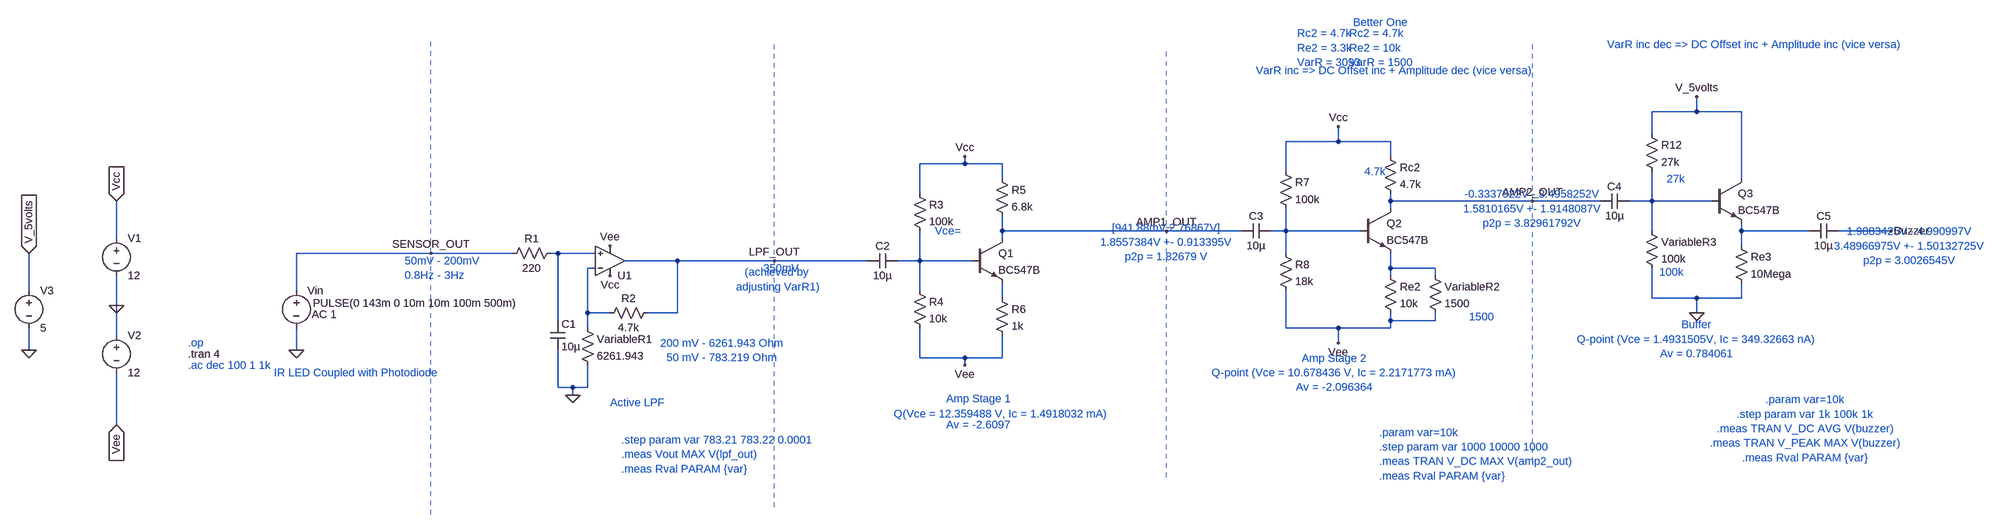
[diagram p0: schematic FINAL (1).asc]
FINAL (1).asc, the LTspice schematic file:
Version 4.1
SHEET 1 4272 964
WIRE 3216 -224 3216 -256
WIRE 3216 -224 3120 -224
WIRE 3312 -224 3216 -224
WIRE 3120 -176 3120 -224
WIRE 2448 -160 2448 -192
WIRE 2448 -160 2336 -160
WIRE 2560 -160 2448 -160
WIRE 2560 -128 2560 -160
WIRE 1648 -112 1648 -128
WIRE 1648 -112 1552 -112
WIRE 1728 -112 1648 -112
WIRE 2336 -96 2336 -160
WIRE 1728 -80 1728 -112
WIRE 3312 -80 3312 -224
WIRE 1552 -48 1552 -112
WIRE 2560 -32 2560 -48
WIRE 2864 -32 2560 -32
WIRE 3008 -32 2864 -32
WIRE 3120 -32 3120 -96
WIRE 3120 -32 3072 -32
WIRE 3248 -32 3120 -32
WIRE 2560 -16 2560 -32
WIRE 1728 32 1728 0
WIRE 2080 32 1728 32
WIRE 2240 32 2080 32
WIRE 2336 32 2336 -16
WIRE 2336 32 2304 32
WIRE 2496 32 2336 32
WIRE 3120 32 3120 -32
WIRE 3312 32 3312 16
WIRE 3456 32 3312 32
WIRE 3632 32 3520 32
WIRE -496 48 -496 -32
WIRE 1728 48 1728 32
WIRE 3312 64 3312 32
WIRE 496 80 208 80
WIRE 672 80 496 80
WIRE 768 80 752 80
WIRE 848 80 768 80
WIRE 2336 80 2336 32
WIRE 1024 96 912 96
WIRE 1232 96 1024 96
WIRE 1440 96 1232 96
WIRE 1552 96 1552 32
WIRE 1552 96 1504 96
WIRE 1664 96 1552 96
WIRE 848 112 832 112
WIRE 2560 112 2560 80
WIRE 2656 112 2560 112
WIRE 2560 128 2560 112
WIRE 2656 128 2656 112
WIRE -720 160 -720 80
WIRE 208 160 208 80
WIRE 1552 160 1552 96
WIRE 1728 176 1728 144
WIRE 3120 176 3120 112
WIRE 3216 176 3120 176
WIRE 3312 176 3312 144
WIRE 3312 176 3216 176
WIRE -496 192 -496 128
WIRE 832 208 832 112
WIRE 880 208 832 208
WIRE 1024 208 1024 96
WIRE 1024 208 960 208
WIRE 3216 208 3216 176
WIRE 768 224 768 80
WIRE 2560 224 2560 208
WIRE 2656 224 2656 208
WIRE 2656 224 2560 224
WIRE 832 240 832 208
WIRE 2336 240 2336 160
WIRE 2448 240 2336 240
WIRE 2560 240 2560 224
WIRE 2560 240 2448 240
WIRE -496 256 -496 192
WIRE 2448 272 2448 240
WIRE -720 288 -720 240
WIRE 208 288 208 240
WIRE 1552 304 1552 240
WIRE 1648 304 1552 304
WIRE 1728 304 1728 256
WIRE 1728 304 1648 304
WIRE 1648 320 1648 304
WIRE 768 368 768 288
WIRE 800 368 768 368
WIRE 832 368 832 320
WIRE 832 368 800 368
WIRE 800 384 800 368
WIRE -496 448 -496 336
FLAG 208 288 0
FLAG -496 192 0
FLAG -496 -32 Vcc
IOPIN -496 -32 In
FLAG -496 448 Vee
IOPIN -496 448 In
FLAG 800 384 0
FLAG 880 128 Vcc
FLAG 880 64 Vee
FLAG 1648 -128 Vcc
FLAG 1648 320 Vee
FLAG 2448 -192 Vcc
FLAG 2448 272 Vee
FLAG -720 288 0
FLAG -720 80 V_5volts
IOPIN -720 80 In
FLAG 3216 -256 V_5volts
FLAG 496 80 SENSOR_OUT
FLAG 1232 96 LPF_OUT
FLAG 2080 32 AMP1_OUT
FLAG 2864 -32 AMP2_OUT
FLAG 3216 208 0
FLAG 3632 32 Buzzer
DATAFLAG 3312 -144 "$-V(Buzzer)"
DATAFLAG 1728 32 "$-V(N008)"
DATAFLAG 2560 -32 "$-V(N007)"
DATAFLAG 1728 32 "$-V(N008)"
SYMBOL voltage 208 144 R0
WINDOW 3 35 43 Left 2
WINDOW 123 33 67 Left 2
WINDOW 39 0 0 Left 0
SYMATTR Value PULSE(0 143m 0 10m 10m 100m 500m)
SYMATTR Value2 AC 1
SYMATTR InstName Vin
SYMBOL res 768 64 R90
WINDOW 0 0 56 VBottom 2
WINDOW 3 32 56 VTop 2
SYMATTR InstName R1
SYMATTR Value 220
SYMBOL voltage -496 32 R0
SYMATTR InstName V1
SYMATTR Value 12
SYMBOL voltage -496 240 R0
SYMATTR InstName V2
SYMATTR Value 12
SYMBOL cap 752 224 R0
SYMATTR InstName C1
SYMATTR Value 10µ
SYMBOL res 976 192 R90
WINDOW 0 0 56 VBottom 2
WINDOW 3 32 56 VTop 2
SYMATTR InstName R2
SYMATTR Value 4.7k
SYMBOL res 816 224 R0
SYMATTR InstName VariableR1
SYMATTR Value 6261.943
SYMBOL cap 1504 80 R90
WINDOW 0 0 32 VBottom 2
WINDOW 3 32 32 VTop 2
SYMATTR InstName C2
SYMATTR Value 10µ
SYMBOL res 1536 -64 R0
SYMATTR InstName R3
SYMATTR Value 100k
SYMBOL res 1536 144 R0
SYMATTR InstName R4
SYMATTR Value 10k
SYMBOL res 1712 -96 R0
SYMATTR InstName R5
SYMATTR Value 6.8k
SYMBOL res 1712 160 R0
SYMATTR InstName R6
SYMATTR Value 1k
SYMBOL npn 1664 48 R0
SYMATTR InstName Q1
SYMATTR Value BC547B
SYMBOL cap 2304 16 R90
WINDOW 0 0 32 VBottom 2
WINDOW 3 32 32 VTop 2
SYMATTR InstName C3
SYMATTR Value 10µ
SYMBOL res 2320 -112 R0
SYMATTR InstName R7
SYMATTR Value 100k
SYMBOL res 2320 64 R0
SYMATTR InstName R8
SYMATTR Value 18k
SYMBOL res 2544 -144 R0
SYMATTR InstName Rc2
SYMATTR Value 4.7k
SYMBOL npn 2496 -16 R0
SYMATTR InstName Q2
SYMATTR Value BC547B
SYMBOL res 2544 112 R0
SYMATTR InstName Re2
SYMATTR Value 10k
SYMBOL cap 3072 -48 R90
WINDOW 0 0 32 VBottom 2
WINDOW 3 32 32 VTop 2
SYMATTR InstName C4
SYMATTR Value 10µ
SYMBOL res 3104 -192 R0
SYMATTR InstName R12
SYMATTR Value 27k
SYMBOL res 3104 16 R0
SYMATTR InstName VariableR3
SYMATTR Value 100k
SYMBOL npn 3248 -80 R0
SYMATTR InstName Q3
SYMATTR Value BC547B
SYMBOL res 3296 48 R0
SYMATTR InstName Re3
SYMATTR Value 10Mega
SYMBOL voltage -720 144 R0
WINDOW 123 0 0 Left 0
WINDOW 39 0 0 Left 0
SYMATTR InstName V3
SYMATTR Value 5
SYMBOL OpAmps\\UniversalOpAmp2 880 96 M180
SYMATTR InstName U1
SYMBOL res 2640 112 R0
SYMATTR InstName VariableR2
SYMATTR Value 1500
SYMBOL cap 3520 16 R90
WINDOW 0 0 32 VBottom 2
WINDOW 3 32 32 VTop 2
SYMATTR InstName C5
SYMATTR Value 10µ
TEXT -24 296 Left 2 !.tran 4
TEXT 160 336 Left 2 ;IR LED Coupled with Photodiode
TEXT 880 400 Left 2 ;Active LPF
TEXT 1608 392 Left 2 ;Amp Stage 1
TEXT -24 320 Left 2 ;.ac dec 100 1 1k
TEXT 1208 112 Left 2 ;350mV
TEXT -24 272 Left 2 ;.op
TEXT 1240 136 Center 2 ;(achieved by \nadjusting VarR1)
TEXT 904 480 Left 2 ;.step param var 783.21 783.22 0.0001\n.meas Vout MAX V(lpf_out)\n.meas Rval PARAM {var}
TEXT 1496 424 Left 2 ;Q(Vce = 12.359488 V, Ic = 1.4918032 mA)
TEXT 440 96 Left 2 ;50mV - 200mV\n0.8Hz - 3Hz
TEXT 2080 56 Center 2 ;[941.88mV,2.76867V]\n1.8557384V +- 0.913395V\np2p = 1.82679 V
TEXT 1608 448 Left 2 ;Av = -2.6097
TEXT 2536 464 Left 2 ;.param var=10k\n.step param var 1000 10000 1000\n.meas TRAN V_DC MAX V(amp2_out)\n.meas Rval PARAM {var}
TEXT 2440 336 Center 2 ;Amp Stage 2\nQ-point (Vce = 10.678436 V, Ic = 2.2171773 mA)\nAv = -2.096364
TEXT 2864 -16 Center 2 ;-0.3337922V - 3.4958252V\n1.5810165V +- 1.9148087V\np2p = 3.82961792V
TEXT 1120 288 Center 2 ;200 mV - 6261.943 Ohm\n50 mV - 783.219 Ohm
TEXT 2360 -392 Left 2 ;Rc2 = 4.7k\nRe2 = 3.3k\nVarR = 3093
TEXT 3448 456 Center 2 ;.param var=10k\n.step param var 1k 100k 1k\n.meas TRAN V_DC AVG V(buzzer)\n.meas TRAN V_PEAK MAX V(buzzer)\n.meas Rval PARAM {var}
TEXT 2728 216 Left 2 ;1500
TEXT 2472 -392 Left 2 ;Rc2 = 4.7k\nRe2 = 10k\nVarR = 1500
TEXT 1584 32 Left 2 ;Vce=
TEXT 2272 -312 Left 2 ;VarR inc => DC Offset inc + Amplitude dec (vice versa)
TEXT 3672 64 Center 2 ;1.9883425V - 4.990997V\n3.48966975V +- 1.50132725V\np2p = 3.0026545V
TEXT 3216 264 Center 2 ;Buffer\nQ-point (Vce = 1.4931505V, Ic = 349.32663 nA)\nAv = 0.784061
TEXT 2480 -416 Left 2 ;Better One
TEXT 3136 120 Left 2 ;100k
TEXT 3024 -368 Left 2 ;VarR inc dec => DC Offset inc + Amplitude inc (vice versa)
TEXT 3152 -80 Left 2 ;27k
TEXT 2504 -96 Left 2 ;4.7k
LINE Normal 2864 528 2864 -368 1
LINE Normal 2080 560 2080 -352 1
LINE Normal 1232 624 1232 -368 1
LINE Normal 496 640 496 -384 1
LINE Normal 3552 528 3552 528 2

The netlist it stands for:
* FINAL (1).asc
Vin SENSOR_OUT 0 PULSE(0 143m 0 10m 10m 100m 500m) AC 1
R1 N004 SENSOR_OUT 220
V1 Vcc 0 12
V2 0 Vee 12
C1 N004 0 10µ
R2 LPF_OUT N006 4.7k
R§VariableR1 N006 0 6261.943
C2 N005 LPF_OUT 10µ
R3 Vcc N005 100k
R4 N005 Vee 10k
R5 Vcc AMP1_OUT 6.8k
R6 N008 Vee 1k
Q1 AMP1_OUT N005 N008 0 BC547B
C3 N002 AMP1_OUT 10µ
R7 Vcc N002 100k
R8 N002 Vee 18k
Rc2 Vcc AMP2_OUT 4.7k
Q2 AMP2_OUT N002 N007 0 BC547B
Re2 N007 Vee 10k
C4 N001 AMP2_OUT 10µ
R12 V_5volts N001 27k
R§VariableR3 N001 0 100k
Q3 V_5volts N001 N003 0 BC547B
Re3 N003 0 10Mega
V3 V_5volts 0 5
X§U1 N004 N006 Vcc Vee LPF_OUT level2 Avol=1Meg GBW=10Meg Slew=10Meg Ilimit=25m Rail=0 Vos=0 En=0 Enk=0 In=0 Ink=0 Rin=500Meg  ; pins In+ In- V+ V- OUT
R§VariableR2 N007 Vee 1500
C5 Buzzer N003 10µ
.model NPN NPN
.model PNP PNP
.lib standard.bjt
.tran 4
* IR LED Coupled with Photodiode
* Active LPF
* Amp Stage 1
* .ac dec 100 1 1k
* 350mV
* .op
* (achieved by
* adjusting VarR1)
* .step param var 783.21 783.22 0.0001
* .meas Vout MAX V(lpf_out)
* .meas Rval PARAM {var}
* Q(Vce = 12.359488 V, Ic = 1.4918032 mA)
* 50mV - 200mV
* 0.8Hz - 3Hz
* [941.88mV,2.76867V]
* 1.8557384V +- 0.913395V
* p2p = 1.82679 V
* Av = -2.6097
* .param var=10k
* .step param var 1000 10000 1000
* .meas TRAN V_DC MAX V(amp2_out)
* .meas Rval PARAM {var}
* Amp Stage 2
* Q-point (Vce = 10.678436 V, Ic = 2.2171773 mA)
* Av = -2.096364
* -0.3337922V - 3.4958252V
* 1.5810165V +- 1.9148087V
* p2p = 3.82961792V
* 200 mV - 6261.943 Ohm
* 50 mV - 783.219 Ohm
* Rc2 = 4.7k
* Re2 = 3.3k
* VarR = 3093
* .param var=10k
* .step param var 1k 100k 1k
* .meas TRAN V_DC AVG V(buzzer)
* .meas TRAN V_PEAK MAX V(buzzer)
* .meas Rval PARAM {var}
* 1500
* Rc2 = 4.7k
* Re2 = 10k
* VarR = 1500
* Vce=
* VarR inc => DC Offset inc + Amplitude dec (vice versa)
* 1.9883425V - 4.990997V
* 3.48966975V +- 1.50132725V
* p2p = 3.0026545V
* Buffer
* Q-point (Vce = 1.4931505V, Ic = 349.32663 nA)
* Av = 0.784061
* Better One
* 100k
* VarR inc dec => DC Offset inc + Amplitude inc (vice versa)
* 27k
* 4.7k
.lib UniversalOpAmp2.lib
.backanno
.end